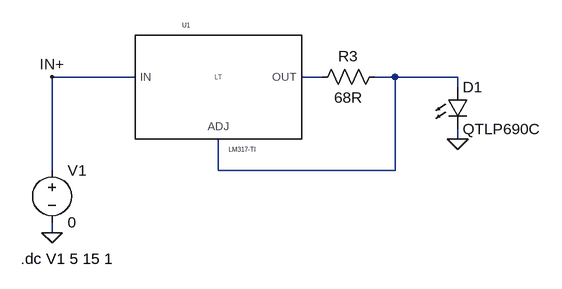
[diagram p0: schematic LM317 Current Regulator on LED (figure 26 On Semiconductor).asc]
LM317 Current Regulator on LED (figure 26 On Semiconductor).asc, the LTspice schematic file:
Version 4
SHEET 1 880 680
WIRE 80 96 -48 96
WIRE 368 96 336 96
WIRE 480 96 448 96
WIRE 576 96 480 96
WIRE 576 112 576 96
WIRE 576 192 576 176
WIRE -48 240 -48 96
WIRE 208 240 208 192
WIRE 480 240 480 96
WIRE 480 240 208 240
WIRE -48 336 -48 320
FLAG -48 336 0
FLAG -48 96 IN+
FLAG 576 192 0
SYMBOL Regulators\\LM317-TI 208 96 R0
SYMATTR InstName U1
SYMBOL res 352 112 R270
WINDOW 0 32 56 VTop 2
WINDOW 3 0 56 VBottom 2
SYMATTR InstName R3
SYMATTR Value 68R
SYMBOL voltage -48 224 R0
WINDOW 123 0 0 Left 0
WINDOW 39 0 0 Left 0
SYMATTR InstName V1
SYMATTR Value 0
SYMBOL LED 560 112 R0
SYMATTR InstName D1
SYMATTR Value QTLP690C
TEXT -96 376 Left 2 !.dc V1 5 15 1

The netlist it stands for:
* LM317 Current Regulator on LED (figure 26 On Semiconductor).asc
XU1 IN+ N002 N001 LM317-TI  ; pins IN ADJ OUT
R3 N001 N002 68R
V1 IN+ 0 0
D1 N002 0 QTLP690C
.model D D
.lib standard.dio
.dc V1 5 15 1
.lib LM317-TI.LIB
.backanno
.end